# EAGLE design vane-anemometer-reeds-new (EAGLE 6.4)
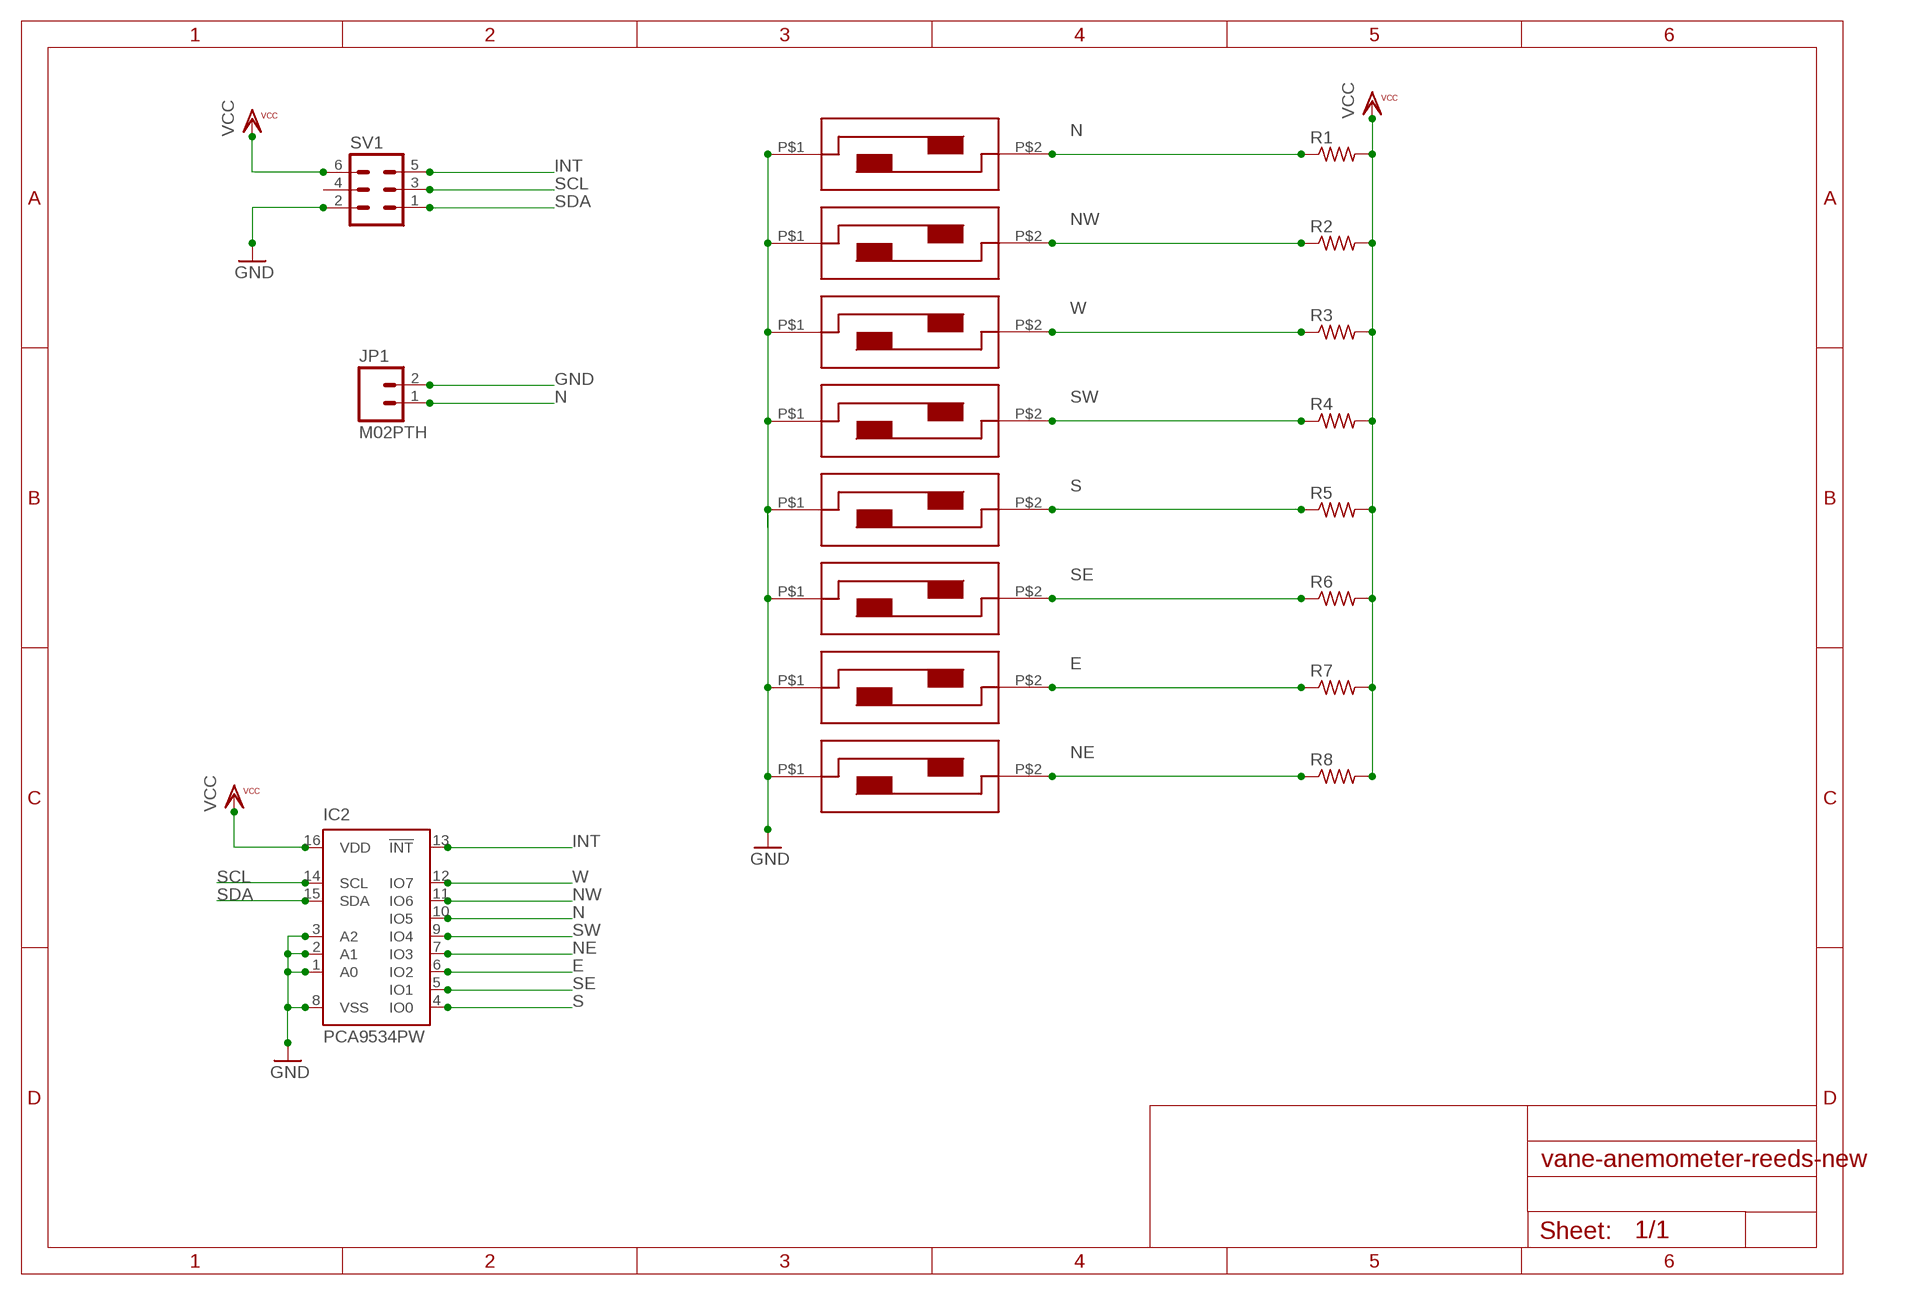
[diagram p0: schematic, sheet 1]

## Parts
EAST  SP3-1A16-3A_REED_SWITCH  [MKA-10110]
IC2  PCA9534PW  [TSSOP16]
JP1  M02PTH  [1X02]
NORTH  SP3-1A16-3A_REED_SWITCH  [MKA-10110]
NORTHEAST  SP3-1A16-3A_REED_SWITCH  [MKA-10110]
NORTHWEST  SP3-1A16-3A_REED_SWITCH  [MKA-10110]
R1  R-US_R1005  [R1005]
R2  R-US_R1005  [R1005]
R3  R-US_R1005  [R1005]
R4  R-US_R1005  [R1005]
R5  R-US_R1005  [R1005]
R6  R-US_R1005  [R1005]
R7  R-US_R1005  [R1005]
R8  R-US_R1005  [R1005]
SOUTH  SP3-1A16-3A_REED_SWITCH  [MKA-10110]
SOUTHEAST  SP3-1A16-3A_REED_SWITCH  [MKA-10110]
SOUTHWEST  SP3-1A16-3A_REED_SWITCH  [MKA-10110]
SV1  MA03-2  [MA03-2]
WEST  SP3-1A16-3A_REED_SWITCH  [MKA-10110]

## Nets
E: EAST.P$2 IC2.6(IO2) R7.1
GND: EAST.P$1 IC2.1(A0) IC2.2(A1) IC2.3(A2) IC2.8(VSS) JP1.2 NORTH.P$1 NORTHEAST.P$1 NORTHWEST.P$1 SOUTH.P$1 SOUTHEAST.P$1 SOUTHWEST.P$1 SV1.2 WEST.P$1
INT: IC2.13(!INT) SV1.5
N: IC2.10(IO5) JP1.1 NORTH.P$2 R1.1
NE: IC2.7(IO3) NORTHEAST.P$2 R8.1
NW: IC2.11(IO6) NORTHWEST.P$2 R2.1
S: IC2.4(IO0) R5.1 SOUTH.P$2
SCL: IC2.14(SCL) SV1.3
SDA: IC2.15(SDA) SV1.1
SE: IC2.5(IO1) R6.1 SOUTHEAST.P$2
SW: IC2.9(IO4) R4.1 SOUTHWEST.P$2
VCC: IC2.16(VDD) R1.2 R2.2 R3.2 R4.2 R5.2 R6.2 R7.2 R8.2 SV1.6
W: IC2.12(IO7) R3.1 WEST.P$2
Unconnected: SV1.4

## Library data of the parts
EAST NORTH NORTHEAST NORTHWEST SOUTH SOUTHEAST SOUTHWEST WEST = DIY-SciB.org:SP3-1A16-3A_REED_SWITCH: Syntex Tech Corp Micro reed switch MKA-10110 / SP3-1A16-3A 0.5A, 15W, 150V -60C to +125C temperature
IC2 = micro-philips:PCA9534: 8-bit I2C-bus and SMBus low power I/O port with interrupt Source: www.nxp.com .. PCA9534_3.pdf; MPN: PCA9534PW; OC_FARNELL: 1408285; OC_NEWARK: 18M7516
JP1 = SparkFun-Connectors:M02: Standard 2-pin 0.1" header. Use with - straight break away headers ( PRT-00116) - right angle break away headers (PRT-00553) - swiss pins (PRT-00743) - machine pins (PRT-00117) - female headers (PRT-00115) Molex polarized connector foot print use with: PRT-08233 with associated crimp pins and housings. 2.54_SCREWTERM for use with PRT-10571. 3.5mm Screw Terminal footprints for PRT-08084 5mm Screw Terminal footprints for use with PRT-08433
R1-R8 = adafruit:R-US_: RESISTOR, American symbol
SV1 = con-lstb:MA03-2: PIN HEADER; OC_FARNELL: unknown; OC_NEWARK: unknown

## Board
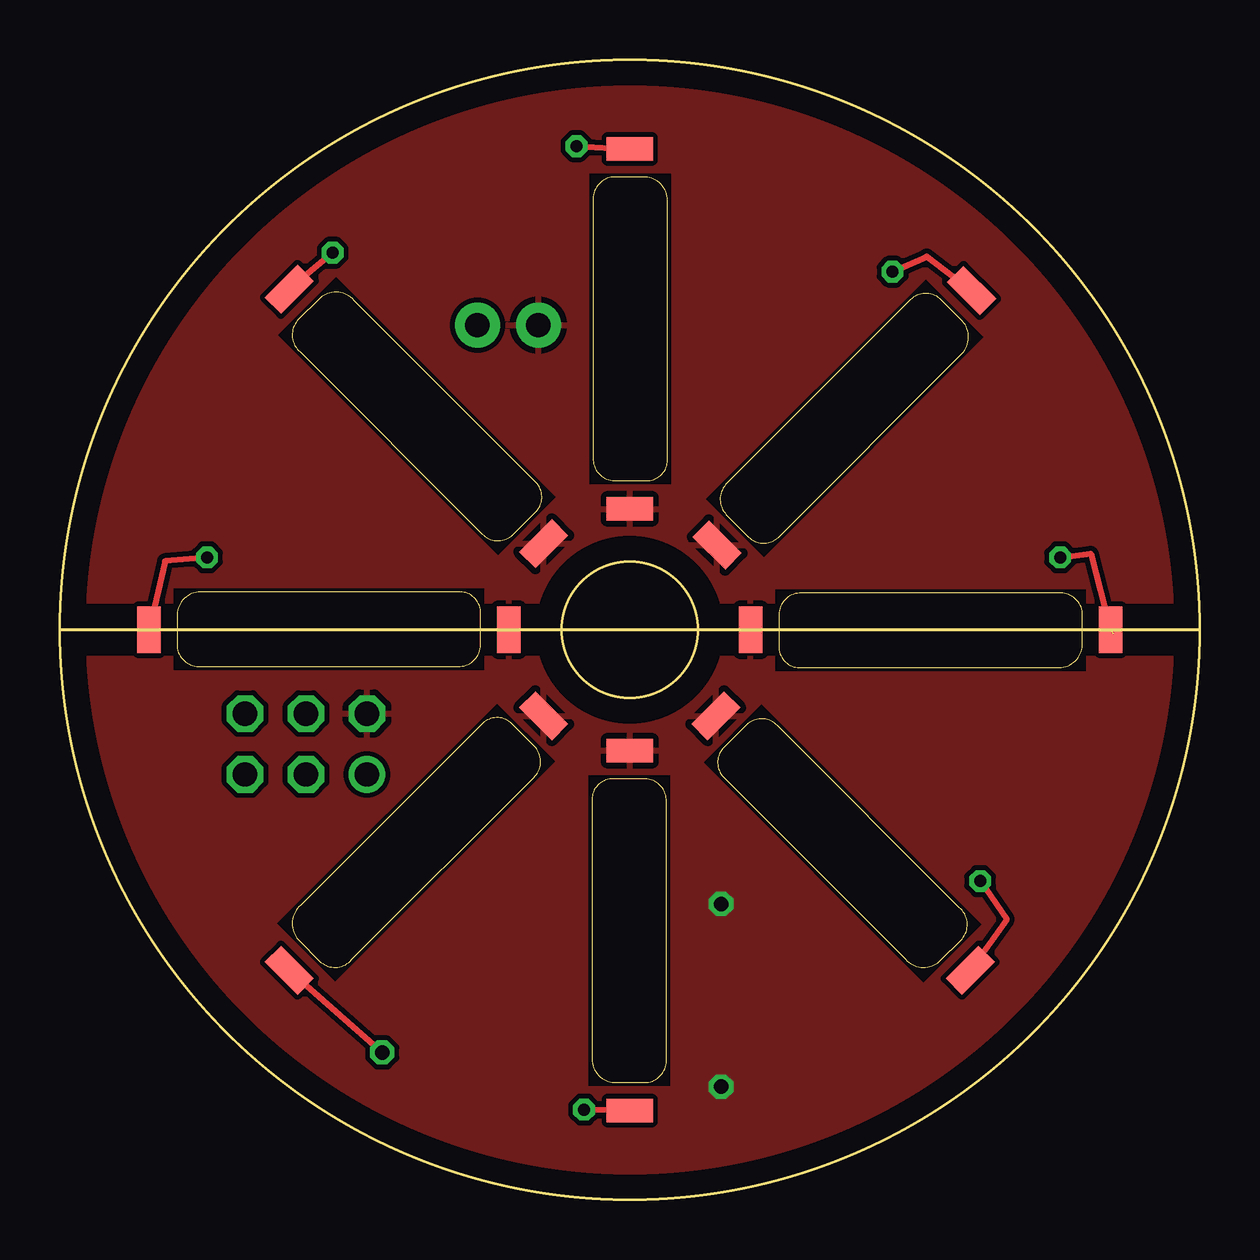
[diagram p1: board, top side]
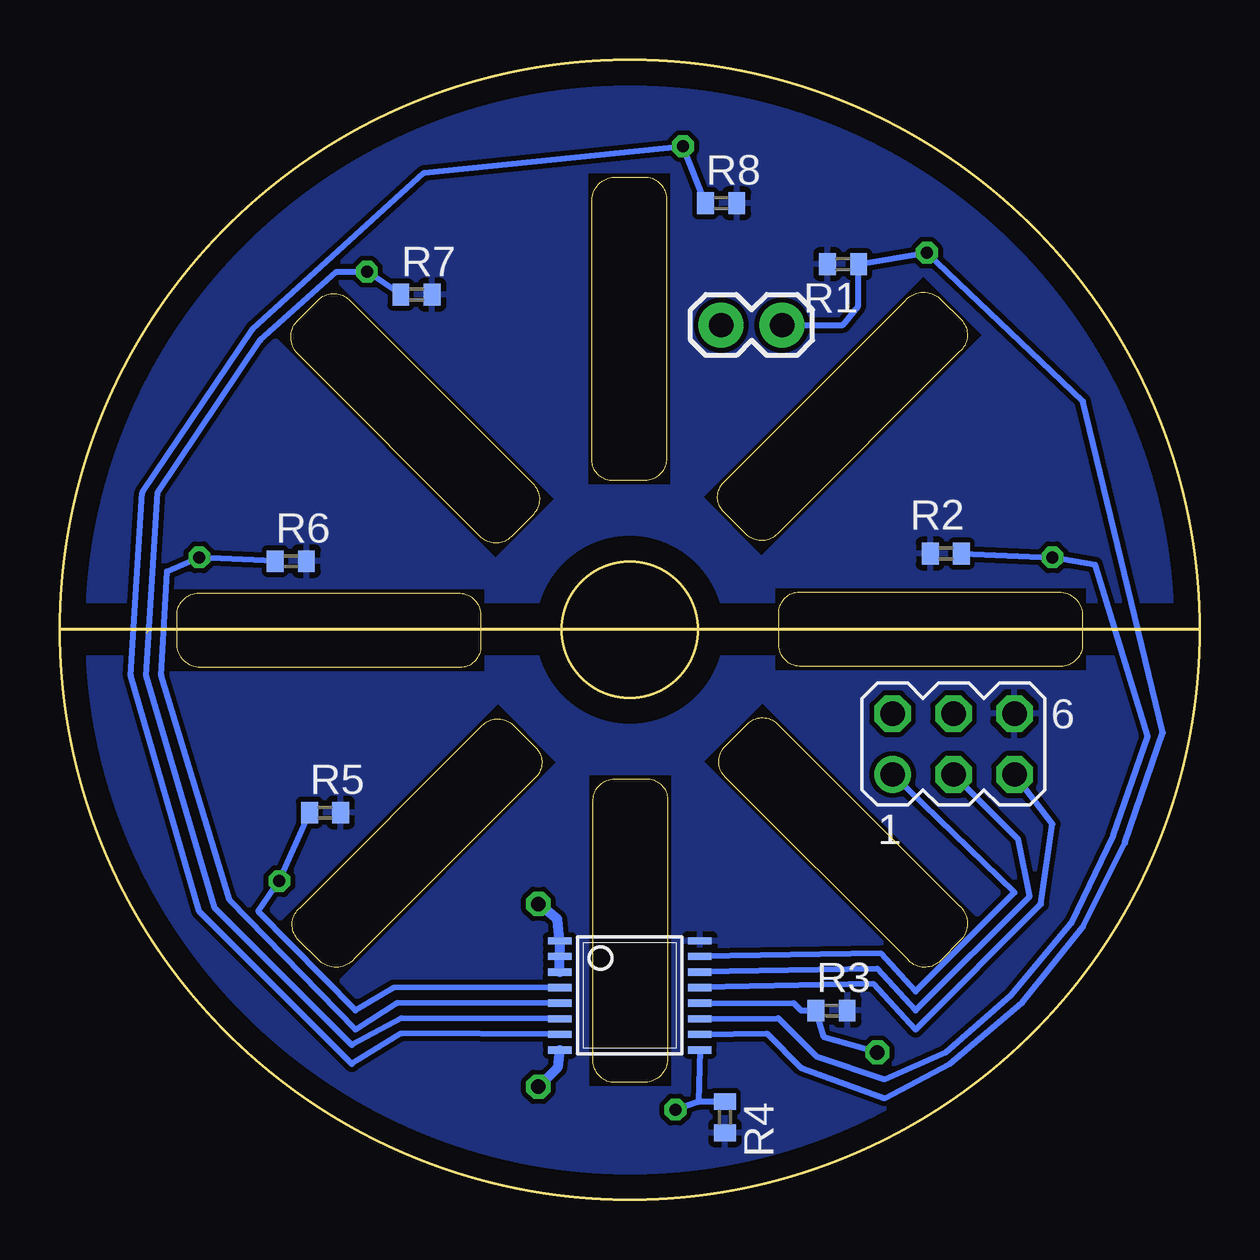
[diagram p2: board, bottom side, seen from below]

Size 47.5 x 47.5 mm. Coordinates in mm from the lower left corner, seen from the top.
Outline: circle at 23.75,23.75 radius 23.75
Outline: circle at 23.75,23.75 radius 2.84
Copper layers (1*16): Top 0.035mm / dielectric 1.5mm / Bottom 0.035mm
Design rules "default": minimum track width 10mil, minimum drill 24mil, track to track 8mil, track to pad 8mil, pad to pad 8mil, via to via 8mil, smd to smd 8mil, copper to edge 40mil, drill to drill 8mil, minimum pad ring 10mil, minimum via ring 8mil, stop-mask expansion 4mil, vias tented up to drill 0mil, thermal gap 10mil

### Footprints (pad centres in the part's own frame; a part is rotated, then mirrored left to right if it is on the bottom)
MKA-10110 = smd 0.965 x 1.93: P$1 -7.5,0; P$2 7.5,0
TSSOP16 = smd 0.305 x 0.991: 1 -2.275,-2.918; 2 -1.625,-2.918; 3 -0.975,-2.918; 4 -0.325,-2.918; 5 0.325,-2.918; 6 0.975,-2.918; 7 1.625,-2.918; 8 2.275,-2.918; 9 2.275,2.918; 10 1.625,2.918; 11 0.975,2.918; 12 0.325,2.918; 13 -0.325,2.918; 14 -0.975,2.918; 15 -1.625,2.918; 16 -2.275,2.918
1X02 = drill 1.016 pad 1.88: 1 0,0; 2 2.54,0
R1005 = smd 0.7 x 0.9: 1 -0.65,0; 2 0.65,0
MA03-2 = drill 1.016: 1 -2.54,-1.27 | drill 1.016 octagon: 2 -2.54,1.27; 3 0,-1.27; 4 0,1.27; 5 2.54,-1.27; 6 2.54,1.27

### Placement (x,y rotation side)
EAST  32.69,32.59 45 top
IC2  23.75,8.51 270 bottom
JP1  17.4,36.45 180 bottom
NORTH  14.86,32.64 135 top
NORTHEAST  23.75,36.29 90 top
NORTHWEST  11.21,23.75 180 top
R1  14.86,38.99 180 bottom
R2  10.57,26.93 180 bottom
R3  15.34,7.88 0 bottom
R4  19.78,3.43 270 bottom
R5  36.45,16.13 0 bottom
R6  37.88,26.61 0 bottom
R7  32.64,37.72 0 bottom
R8  19.94,41.53 0 bottom
SOUTH  32.64,14.86 315 top
SOUTHEAST  36.29,23.75 0 top
SOUTHWEST  23.75,11.21 270 top
SV1  10.26,18.99 0 bottom
WEST  14.86,14.86 225 top

### Tracks (layer width: path | path; a pad name or v marks a point on that pad's centre or on a via)
E  (via drill 0.5)
  Top 0.254: v34.7,38.67 36.13,39.31 EAST.P$2
  Bottom 0.254: R7.1 v34.7,38.67 35.97,38.67 39.15,35.81 43.44,29.46 43.91,21.85 41.05,12.16 35.34,6.45 33.28,7.56 IC2.6
GND  (via drill 0.6)
  Bottom 0.406: IC2.3 IC2.2 IC2.1 26.77,11.69 v27.56,12.32 | IC2.8 26.77,5.49 v27.56,4.7
  pour Top: -0.38,47.88 -0.38,-0.38 47.88,-0.38 47.88,47.88
INT
  Bottom 0.254: IC2.13 13.59,8.99 11.84,7.08 6.61,12.32 6.13,15.65 SV1.5
N  (via drill 0.5)
  Top 0.254: v11.37,39.47 NORTH.P$2
  Bottom 0.254: IC2.10 18.04,6.92 16.61,5.49 13.11,4.22 10.42,5.65 7.4,8.19 4.86,11.37 3.11,14.86 1.53,19.46 4.86,33.28 v11.37,39.47 R1.1 14.23,37.24 14.86,36.45 JP1.1
NE  (via drill 0.5)
  Top 0.254: v21.53,43.91 NORTHEAST.P$2
  Bottom 0.254: R8.1 v21.53,43.91 32.32,42.8 39.47,36.29 44.07,29.46 44.55,21.85 41.69,12 35.34,5.65 33.28,6.92 IC2.7
NW  (via drill 0.5)
  Top 0.254: v6.13,26.77 4.38,26.61 NORTHWEST.P$2
  Bottom 0.254: R2.1 v6.13,26.77 4.35,26.46 2.16,19.3 3.59,15.18 5.34,11.53 7.88,8.51 10.57,6.13 13.11,5.02 15.97,5.97 17.56,7.56 IC2.11
S  (via drill 0.5)
  Top 0.254: v38.36,13.27 39.47,11.69 SOUTH.P$2
  Bottom 0.254: R5.1 v38.36,13.27 39.23,12.02 35.18,7.88 33.59,8.83 IC2.4
SCL
  Bottom 0.254: IC2.14 13.43,9.62 11.84,7.88 7.08,12.64 7.56,15.02 SV1.3
SDA
  Bottom 0.254: SV1.1 7.72,12.8 11.84,8.67 13.27,10.26 IC2.15
SE  (via drill 0.5)  (1 unrouted)
  Top 0.254: 43.91,23.59 43.59,23.59 | v41.69,26.77 42.96,26.93 SOUTHEAST.P$2
  Bottom 0.254: R6.1 v41.69,26.77 43.04,26.19 43.28,21.85 40.42,12.48 35.18,7.08 33.43,8.19 IC2.5
SW  (via drill 0.5)
  Top 0.254: SOUTHWEST.P$2 v21.85,3.75
  Bottom 0.254: IC2.9 20.89,4.07 | 20.89,4.07 v21.85,3.75 | R4.1 20.89,4.07
VCC
  pour Bottom: -0.38,-0.38 51.69,-0.38 51.69,47.88 -0.38,47.88
W  (via drill 0.6)
  Top 0.254: WEST.P$2 v13.43,6.13
  Bottom 0.254: v13.43,6.13 15.65,6.76 R3.1 16.61,7.88 16.92,8.19 IC2.12

### Text on the board
tValues: NORTH | EAST | WEST | SOUTH